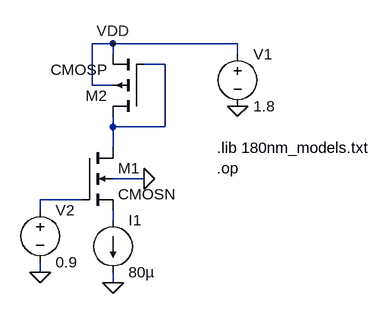
[diagram p0: schematic DIF-1.asc]
DIF-1.asc, the LTspice schematic file:
Version 4
SHEET 1 880 680
WIRE -16 -176 -48 -176
WIRE 176 -176 -16 -176
WIRE -16 -160 -16 -176
WIRE 176 -160 176 -176
WIRE 64 -144 32 -144
WIRE -48 -112 -48 -176
WIRE -16 -112 -48 -112
WIRE -16 -48 -16 -64
WIRE 64 -48 64 -144
WIRE 64 -48 -16 -48
WIRE -16 -16 -16 -48
WIRE 32 32 -16 32
WIRE -64 64 -128 64
WIRE -128 80 -128 64
WIRE -16 96 -16 80
WIRE -128 176 -128 160
WIRE -16 192 -16 176
FLAG 176 -80 0
FLAG 32 32 0
FLAG -128 176 0
FLAG -16 192 0
FLAG -16 -176 VDD
SYMBOL nmos4 -64 -16 R0
SYMATTR InstName M1
SYMATTR Value CMOSN
SYMATTR Value2 l=0.5u w=0.5u m=6
SYMBOL pmos4 32 -64 R180
SYMATTR InstName M2
SYMATTR Value CMOSP
SYMATTR Value2 l=0.5u w=6u m=16
SYMBOL voltage 176 -176 R0
WINDOW 123 0 0 Left 0
WINDOW 39 0 0 Left 0
SYMATTR InstName V1
SYMATTR Value 1.8
SYMBOL voltage -128 64 R0
WINDOW 123 0 0 Left 0
WINDOW 39 0 0 Left 0
SYMATTR InstName V2
SYMATTR Value 0.9
SYMBOL current -16 96 R0
WINDOW 123 0 0 Left 0
WINDOW 39 0 0 Left 0
SYMATTR InstName I1
SYMATTR Value 80µ
TEXT 144 -16 Left 2 !.lib 180nm_models.txt
TEXT 144 16 Left 2 !.op

The netlist it stands for:
* DIF-1.asc
M1 N001 N002 N003 0 CMOSN l=0.5u w=0.5u m=6
M2 N001 N001 VDD VDD CMOSP l=0.5u w=6u m=16
V1 VDD 0 1.8
V2 N002 0 0.9
I1 N003 0 80µ
.model NMOS NMOS
.model PMOS PMOS
.lib standard.mos
.lib 180nm_models.txt
.op
.backanno
.end